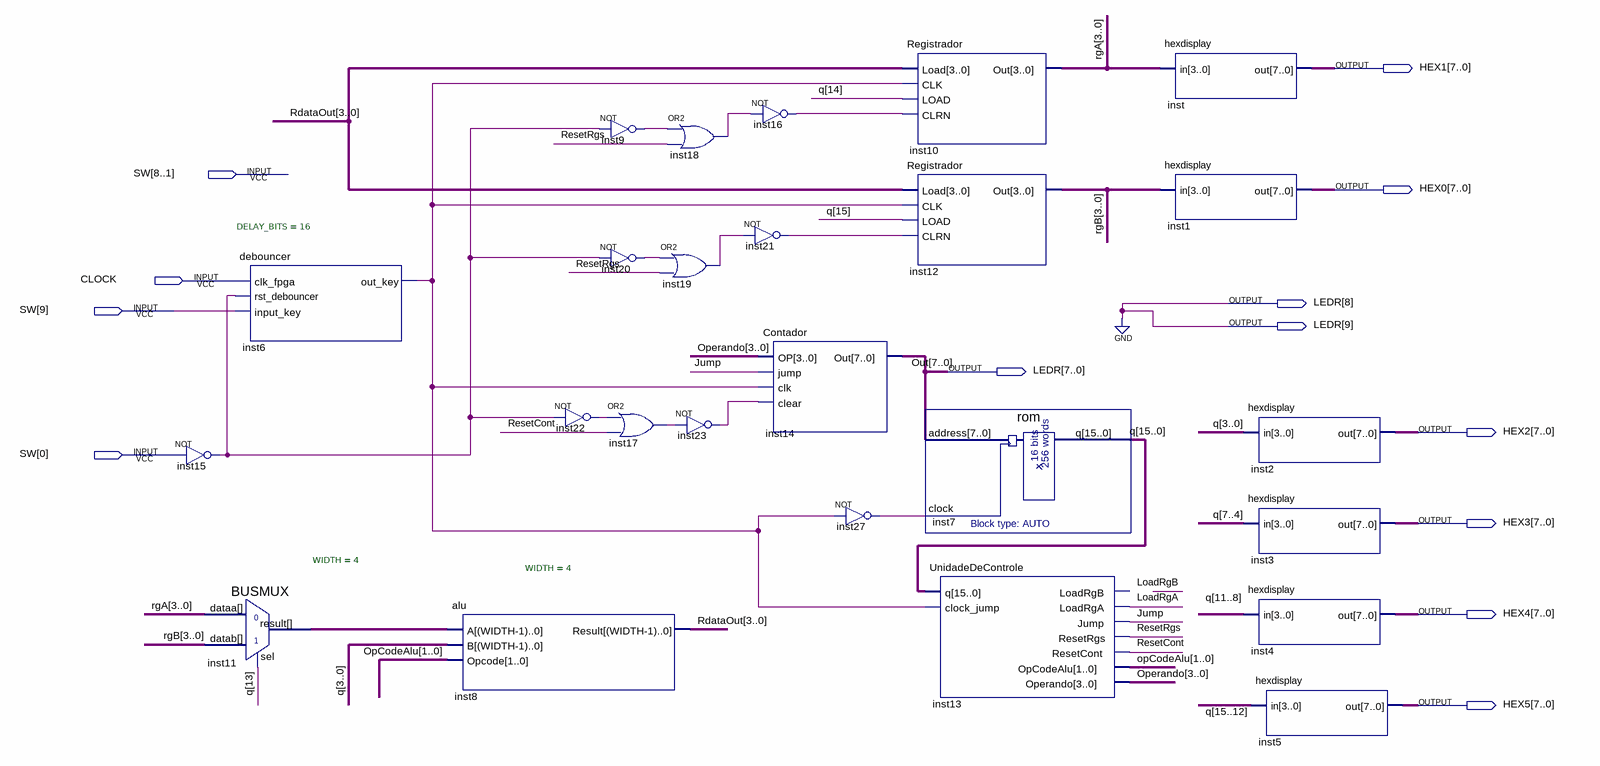
[diagram p0: schematic sheet]
// Quartus schematic main.bdf as structural Verilog: 25 symbols, 13 pins
module main (
  input  [9:0] SW,
  input  CLOCK,
  output [7:0] HEX1,
  output [7:0] HEX0,
  output [9:0] LEDR,
  output [7:0] HEX2,
  output [7:0] HEX3,
  output [7:0] HEX4,
  output [7:0] HEX5
);

  wire inst6_out_key, inst9_out, inst15_out, inst16_out, inst17_out, inst18_out, inst19_out, inst20_out,
       inst21_out, inst22_out, inst23_out, inst27_out, Jump, LoadRgA, ResetCont, ResetRgs;
  wire [1:0] OpCodeAlu;
  wire [3:0] inst11_result, Operando, RdataOut, rgA, rgB;
  wire [15:0] q;

  not inst15 (inst15_out, SW[0]);
  debouncer #(.DELAY_BITS(16)) inst6 (
    .clk_fpga(CLOCK), .rst_debouncer(inst15_out), .input_key(SW[9]), .out_key(inst6_out_key));
  BUSMUX #(.WIDTH(4)) inst11 (.datab(rgB), .sel(q[13]), .dataa(rgA), .result(inst11_result));
  alu #(.WIDTH(4)) inst8 (.A(inst11_result), .B(q[3:0]), .Opcode(OpCodeAlu), .Result(RdataOut));
  not inst9 (inst9_out, inst15_out);
  not inst20 (inst20_out, inst15_out);
  or inst17 (inst17_out, inst22_out, ResetCont);
  not inst22 (inst22_out, inst15_out);
  or inst18 (inst18_out, inst9_out, ResetRgs);
  or inst19 (inst19_out, inst20_out, ResetRgs);
  not inst23 (inst23_out, inst17_out);
  not inst16 (inst16_out, inst18_out);
  not inst21 (inst21_out, inst19_out);
  Contador inst14 (.OP(Operando), .jump(Jump), .clk(inst6_out_key), .clear(inst23_out), .Out(LEDR[7:0]));
  not inst27 (inst27_out, inst6_out_key);
  Registrador inst10 (.Load(RdataOut), .CLK(inst6_out_key), .LOAD(q[14]), .CLRN(inst16_out), .Out(rgA));
  Registrador inst12 (.Load(RdataOut), .CLK(inst6_out_key), .LOAD(q[15]), .CLRN(inst21_out), .Out(rgB));
  rom inst7 (.address(LEDR[7:0]), .clock(inst27_out), .q(q));
  UnidadeDeControle inst13 (
    .q(q), .clock_jump(inst6_out_key), .LoadRgA(LoadRgA), .Jump(Jump), .ResetRgs(ResetRgs),
    .ResetCont(ResetCont), .OpCodeAlu(OpCodeAlu), .Operando(Operando));  // open: LoadRgB
  hexdisplay inst (.in(rgA), .out(HEX1));
  hexdisplay inst1 (.in(rgB), .out(HEX0));
  hexdisplay inst2 (.in(q[3:0]), .out(HEX2));
  hexdisplay inst3 (.in(q[7:4]), .out(HEX3));
  hexdisplay inst4 (.in(q[11:8]), .out(HEX4));
  hexdisplay inst5 (.in(q[15:12]), .out(HEX5));

  assign LEDR[9:8] = 2'b00;

  // Other names for the same wires on the sheet: Out[7:0] = LEDR[7:0]
endmodule
